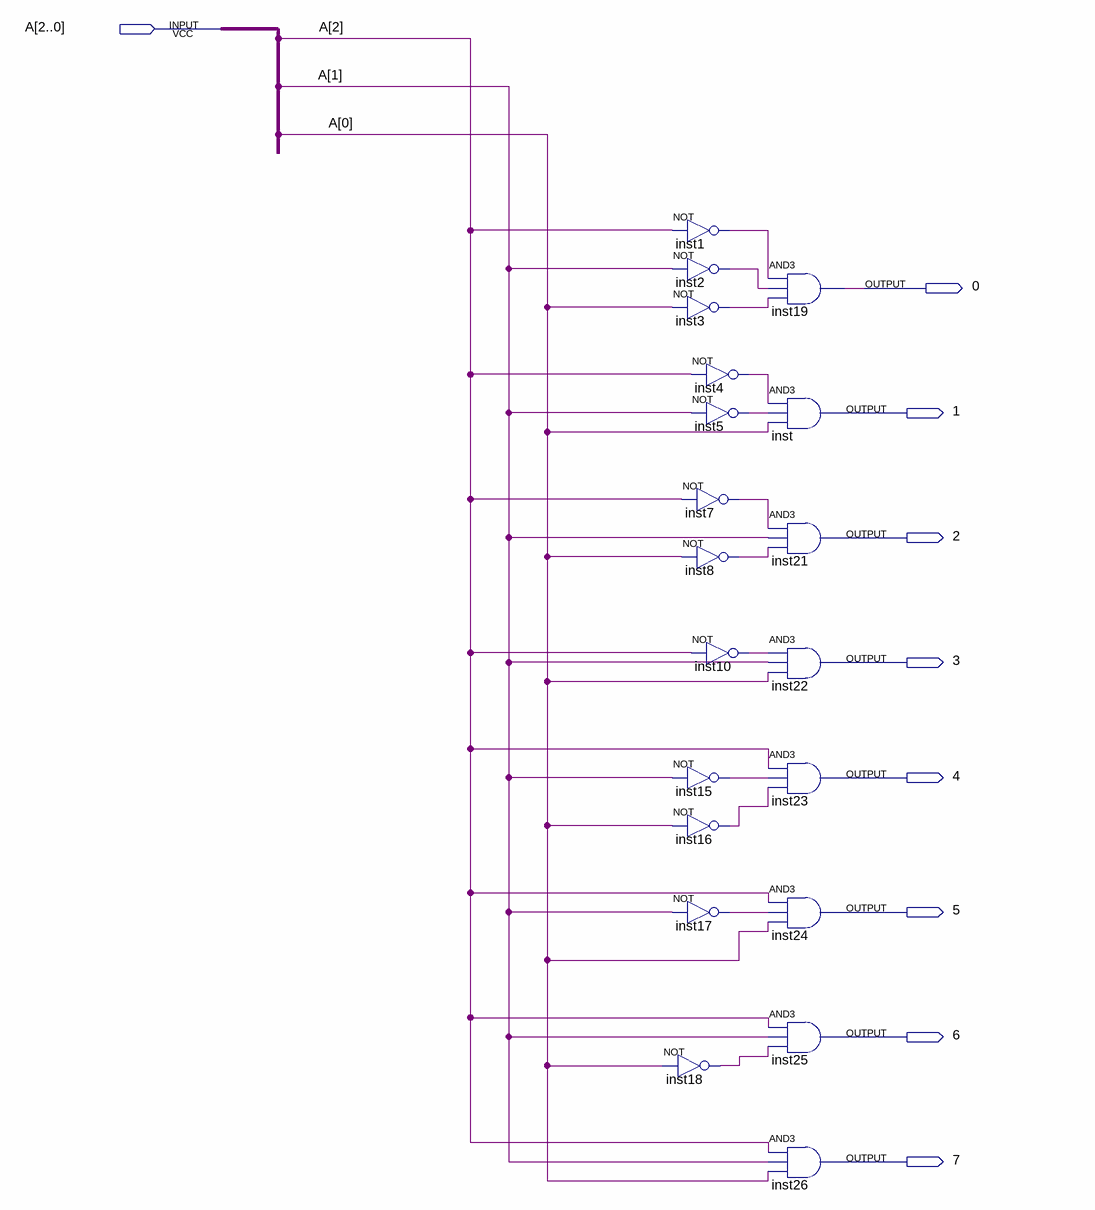
[diagram p0: schematic sheet]
// Quartus schematic Decoder.bdf as structural Verilog: 20 symbols, 9 pins
module Decoder (
  input  [2:0] A,
  output \0 ,
  output \1 ,
  output \2 ,
  output \3 ,
  output \4 ,
  output \5 ,
  output \6 ,
  output \7 
);

  wire inst1_out, inst2_out, inst3_out, inst4_out, inst5_out, inst7_out, inst8_out, inst10_out, inst15_out,
       inst16_out, inst17_out, inst18_out;

  not inst1 (inst1_out, A[2]);
  not inst2 (inst2_out, A[1]);
  not inst3 (inst3_out, A[0]);
  not inst4 (inst4_out, A[2]);
  not inst5 (inst5_out, A[1]);
  not inst7 (inst7_out, A[2]);
  not inst8 (inst8_out, A[0]);
  not inst10 (inst10_out, A[2]);
  not inst15 (inst15_out, A[1]);
  not inst16 (inst16_out, A[0]);
  not inst17 (inst17_out, A[1]);
  not inst18 (inst18_out, A[0]);
  and inst19 (\0 , inst1_out, inst2_out, inst3_out);
  and inst (\1 , inst4_out, inst5_out, A[0]);
  and inst21 (\2 , inst7_out, A[1], inst8_out);
  and inst22 (\3 , inst10_out, A[1], A[0]);
  and inst23 (\4 , A[2], inst15_out, inst16_out);
  and inst24 (\5 , A[2], inst17_out, A[0]);
  and inst25 (\6 , A[2], A[1], inst18_out);
  and inst26 (\7 , A[2], A[1], A[0]);
endmodule
